# Altium project Sidekick Carrier - Rev. 1.PrjPcb (part 2 of 6)

## Sheet 5 Power Supplies.SchDoc
size C; DocumentNumber: 5; SheetNumber: 5; SheetTotal: 17
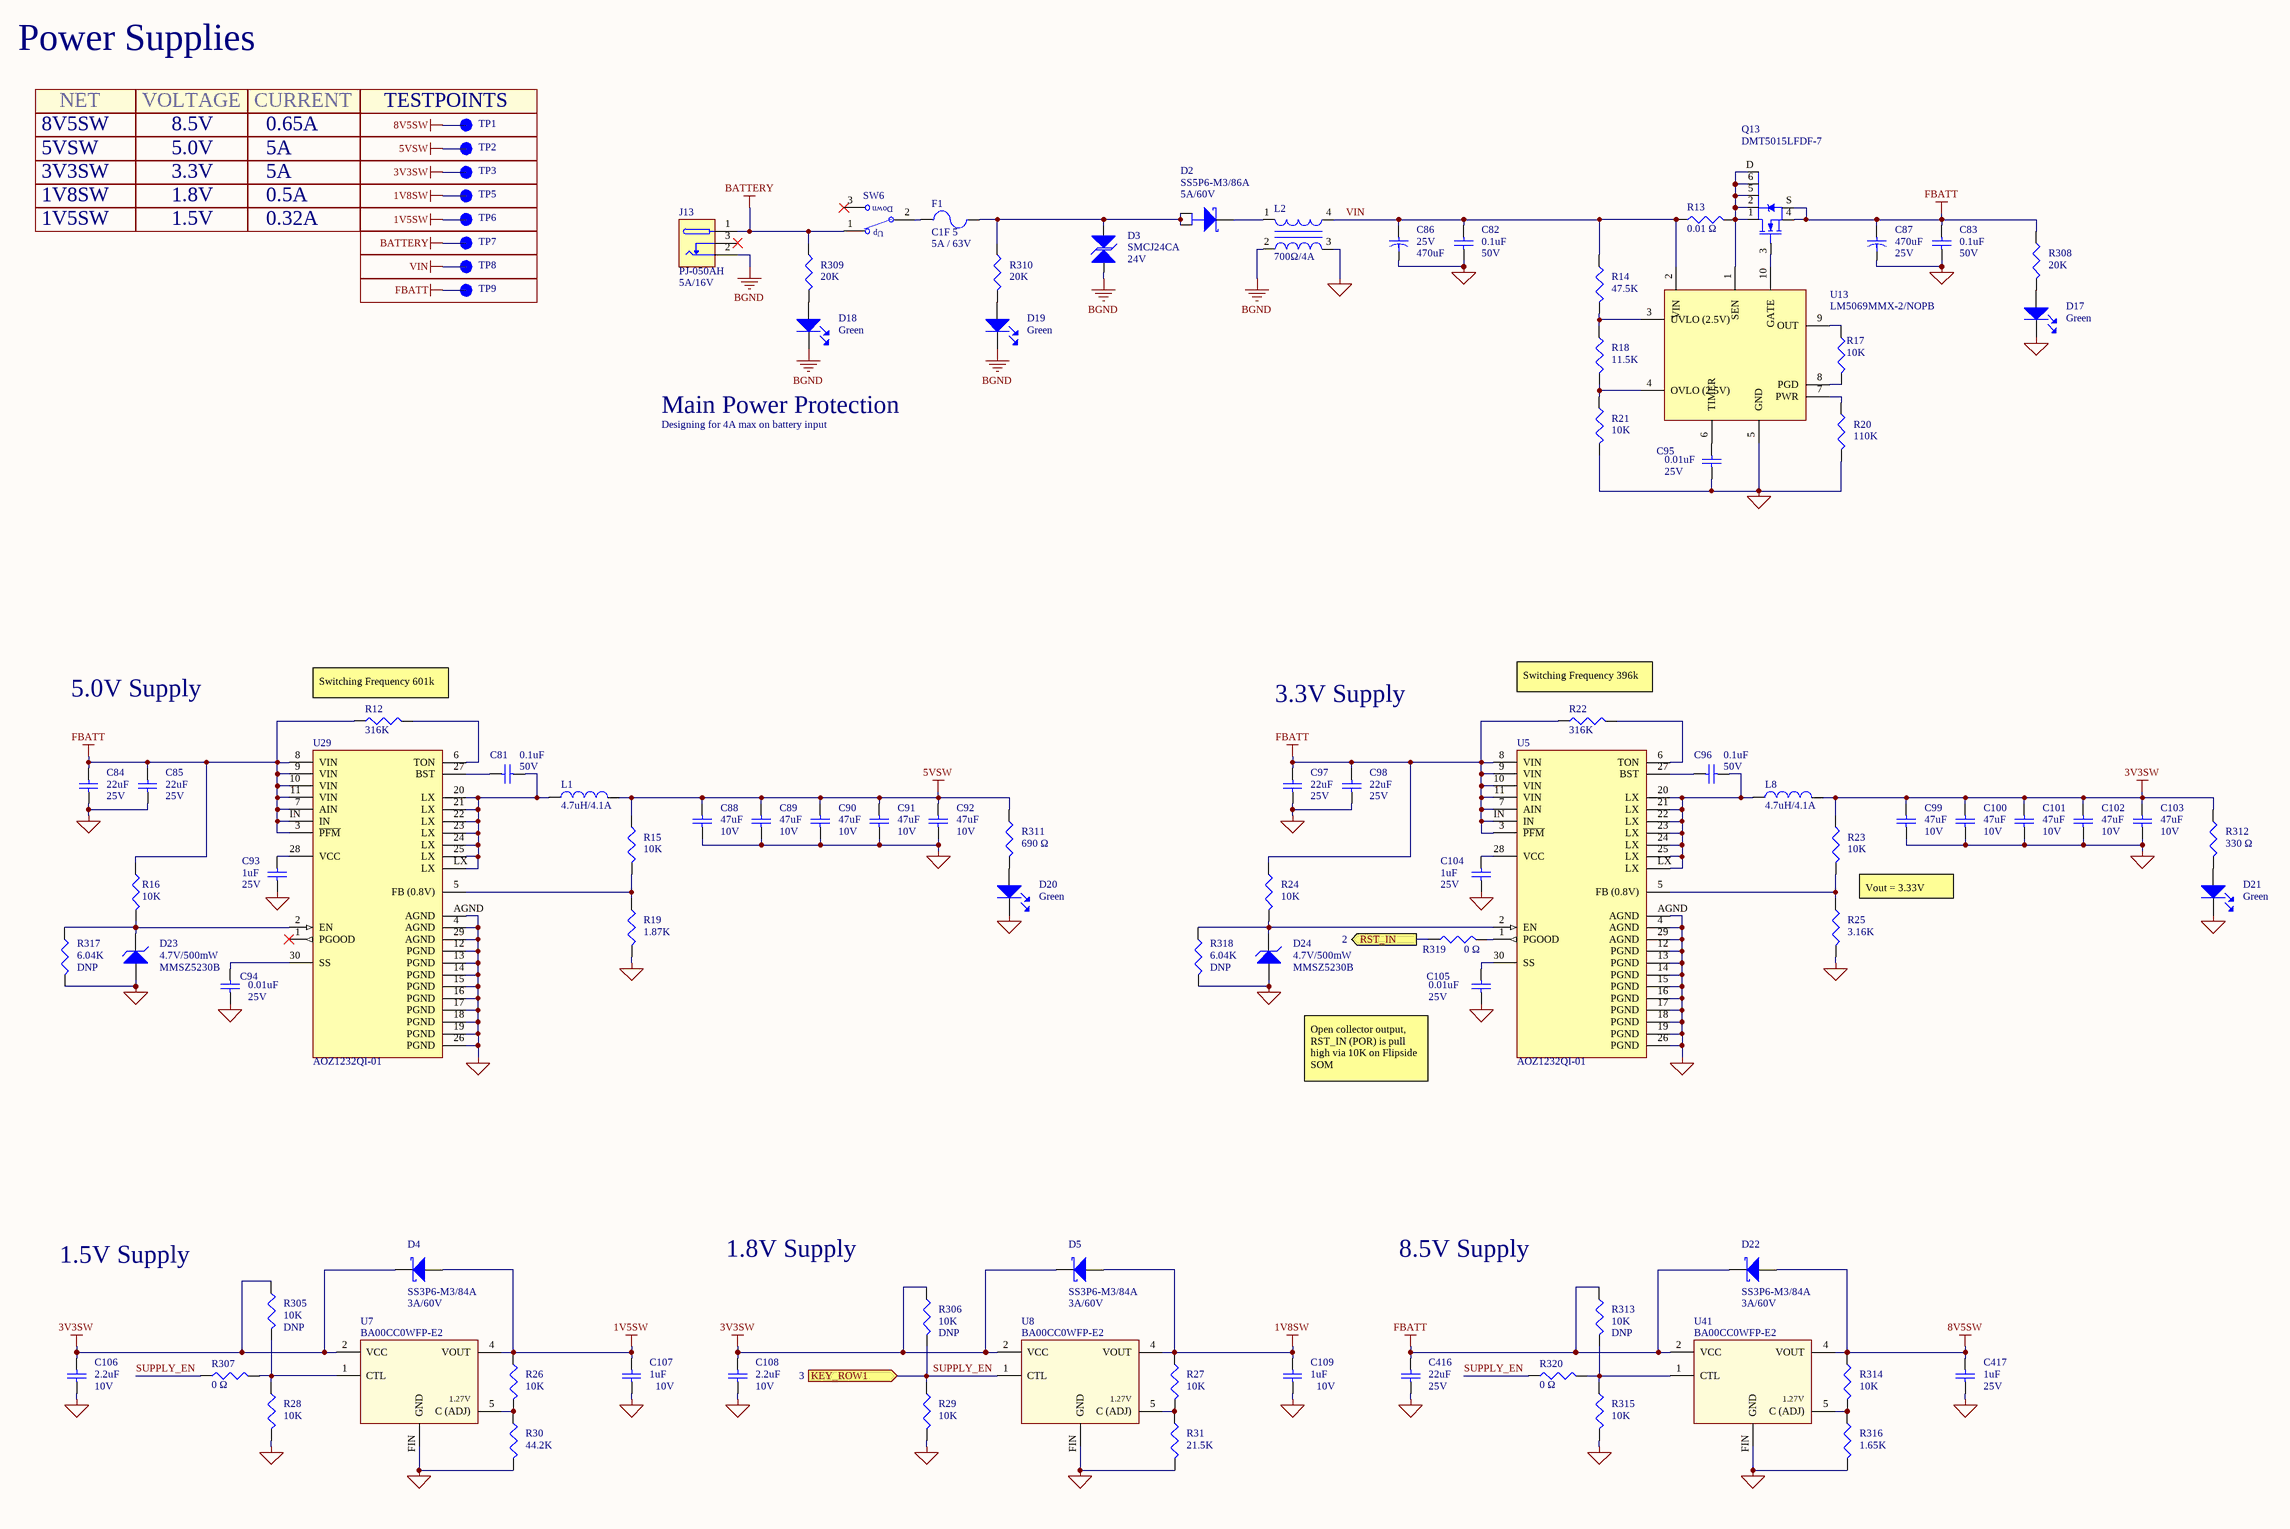
[diagram p4: 5 Power Supplies.SchDoc]

### Parts
C81  value 0.1uF  Voltage: 50V  [CAP_0402]  (hidden comment: Cap 0.1uF 50V 0402)
C82  value 0.1uF  Voltage: 50V  [CAP_0402]  (hidden comment: Cap 0.1uF 50V 0402)
C83  value 0.1uF  Voltage: 50V  [CAP_0402]  (hidden comment: Cap 0.1uF 50V 0402)
C84  value 22uF  Voltage: 25V  [CAP_0805]  (hidden comment: Cap 22uF 25V 0805)
C85  value 22uF  Voltage: 25V  [CAP_0805]  (hidden comment: Cap 22uF 25V 0805)
C86  value 470uF  Voltage: 25V  [SMD(8.3x8.3)_EEE-FT1E471AP]  (hidden comment: Cap 470uF 25V)
C87  value 470uF  Voltage: 25V  [SMD(8.3x8.3)_EEE-FT1E471AP]  (hidden comment: Cap 470uF 25V)
C88  value 47uF  Voltage: 10V  [CAP_1206]  (hidden comment: Cap 47uF 10V 1206)
C89  value 47uF  Voltage: 10V  [CAP_1206]  (hidden comment: Cap 47uF 10V 1206)
C90  value 47uF  Voltage: 10V  [CAP_1206]  (hidden comment: Cap 47uF 10V 1206)
C91  value 47uF  Voltage: 10V  [CAP_1206]  (hidden comment: Cap 47uF 10V 1206)
C92  value 47uF  Voltage: 10V  [CAP_1206]  (hidden comment: Cap 47uF 10V 1206)
C93  value 1uF  Voltage: 25V  [CAP_0402]  (hidden comment: Cap 1uF 25V 0402)
C94  value 0.01uF  Voltage: 25V  [CAP_0402]  (hidden comment: Cap 0.01uF 50V 0402)
C95  value 0.01uF  Voltage: 25V  [CAP_0402]  (hidden comment: Cap 0.01uF 50V 0402)
C96  value 0.1uF  Voltage: 50V  [CAP_0402]  (hidden comment: Cap 0.1uF 50V 0402)
C97  value 22uF  Voltage: 25V  [CAP_0805]  (hidden comment: Cap 22uF 25V 0805)
C98  value 22uF  Voltage: 25V  [CAP_0805]  (hidden comment: Cap 22uF 25V 0805)
C99  value 47uF  Voltage: 10V  [CAP_1206]  (hidden comment: Cap 47uF 10V 1206)
C100  value 47uF  Voltage: 10V  [CAP_1206]  (hidden comment: Cap 47uF 10V 1206)
C101  value 47uF  Voltage: 10V  [CAP_1206]  (hidden comment: Cap 47uF 10V 1206)
C102  value 47uF  Voltage: 10V  [CAP_1206]  (hidden comment: Cap 47uF 10V 1206)
C103  value 47uF  Voltage: 10V  [CAP_1206]  (hidden comment: Cap 47uF 10V 1206)
C104  value 1uF  Voltage: 25V  [CAP_0402]  (hidden comment: Cap 1uF 25V 0402)
C105  value 0.01uF  Voltage: 25V  [CAP_0402]  (hidden comment: Cap 0.01uF 50V 0402)
C106  value 2.2uF  Voltage: 10V  [CAP_0402]  (hidden comment: Cap 2.2uF 10V 0402)
C107  value 1uF  Voltage: 10V  [CAP_0402]  (hidden comment: Cap 1uF 10V 0402)
C108  value 2.2uF  Voltage: 10V  [CAP_0402]  (hidden comment: Cap 2.2uF 10V 0402)
C109  value 1uF  Voltage: 10V  [CAP_0402]  (hidden comment: Cap 1uF 10V 0402)
C416  value 22uF  Voltage: 25V  [CAP_0805]  (hidden comment: Cap 22uF 25V 0805)
C417  value 1uF  Voltage: 25V  [CAP_0402]  (hidden comment: Cap 1uF 25V 0402)
D2  SS5P6-M3/86A  value 5A/60V  [TO-277A_SS5P6]
D3  SMCJ24CA  value 24V  [SMC_SMCJ24CA]
D4  SS3P6-M3/84A  value 3A/60V  [DO-220AA_SS3P6-M3/84A]
D5  SS3P6-M3/84A  value 3A/60V  [DO-220AA_SS3P6-M3/84A]
D17  value Green  [LED_0603]  (hidden comment: LG L29K-G2J1-24-Z)
D18  value Green  [LED_0603]  (hidden comment: LG L29K-G2J1-24-Z)
D19  value Green  [LED_0603]  (hidden comment: LG L29K-G2J1-24-Z)
D20  value Green  [LED_0603]  (hidden comment: LG L29K-G2J1-24-Z)
D21  value Green  [LED_0603]  (hidden comment: LG L29K-G2J1-24-Z)
D22  SS3P6-M3/84A  value 3A/60V  [DO-220AA_SS3P6-M3/84A]
D23  MMSZ5230B  value 4.7V/500mW  [SOD-123_MMSZ5230B]
D24  MMSZ5230B  value 4.7V/500mW  [SOD-123_MMSZ5230B]
F1  C1F 5  value 5A / 63V  [FUSE_1206]
J13  PJ-050AH  value 5A/16V  [CONN_PJ-050AH]
L1  value 4.7uH/4.1A  [IND_NRS8040T4R7NJGJ]  (hidden comment: NRS8040T4R7NJGJ)
L2  value 700Ω/4A  [IND_ACM70V-701-2PL-TL00]  (hidden comment: ACM70V-701-2PL-TL00)
L8  value 4.7uH/4.1A  [IND_NRS8040T4R7NJGJ]  (hidden comment: NRS8040T4R7NJGJ)
Q13  DMT5015LFDF-7  [UDFN-6_DMT5015LFDF-7]
R12  value 316K  [RES_0402]  (hidden comment: Res 316K 0.063W)
R13  value 0.01 Ω  [RES_1210]  (hidden comment: Res 0.01 ohm 0.5W)
R14  value 47.5K  [RES_0402]  (hidden comment: Res 47.5K 0.063W)
R15  value 10K  [RES_0402]  (hidden comment: Res 10K 0.063W)
R16  value 10K  [RES_0402]  (hidden comment: Res 10K 0.063W)
R17  value 10K  [RES_0402]  (hidden comment: Res 10K 0.063W)
R18  value 11.5K  [RES_0402]  (hidden comment: Res 11.5K 0.063W)
R19  value 1.87K  [RES_0402]  (hidden comment: Res 1.87K 0.063W)
R20  value 110K  [RES_0402]  (hidden comment: Res 110K 0.063W)
R21  value 10K  [RES_0402]  (hidden comment: Res 10K 0.063W)
R22  value 316K  [RES_0402]  (hidden comment: Res 316K 0.063W)
R23  value 10K  [RES_0402]  (hidden comment: Res 10K 0.063W)
R24  value 10K  [RES_0402]  (hidden comment: Res 10K 0.063W)
R25  value 3.16K  [RES_0402]  (hidden comment: Res 3.16K 0.063W)
R26  value 10K  [RES_0402]  (hidden comment: Res 10K 0.063W)
R27  value 10K  [RES_0402]  (hidden comment: Res 10K 0.063W)
R28  value 10K  [RES_0402]  (hidden comment: Res 10K 0.063W)
R29  value 10K  [RES_0402]  (hidden comment: Res 10K 0.063W)
R30  value 44.2K  [RES_0402]  (hidden comment: Res 44.2K 0.063W)
R31  value 21.5K  [RES_0402]  (hidden comment: Res 21.5K 0.063W)
R305  value 10K  [RES_0402]  (hidden comment: Res 10K 0.063W)
R306  value 10K  [RES_0402]  (hidden comment: Res 10K 0.063W)
R307  value 0 Ω  [RES_0402]  (hidden comment: Res 0 ohm 0.1W)
R308  value 20K  [RES_0402]  (hidden comment: Res 20K 0.1W)
R309  value 20K  [RES_0402]  (hidden comment: Res 20K 0.1W)
R310  value 20K  [RES_0402]  (hidden comment: Res 20K 0.1W)
R311  value 690 Ω  [RES_0402]  (hidden comment: Res 680R 0.063W)
R312  value 330 Ω  [RES_0402]  (hidden comment: Res 330R 0.063W)
R313  value 10K  [RES_0402]  (hidden comment: Res 10K 0.063W)
R314  value 10K  [RES_0402]  (hidden comment: Res 10K 0.063W)
R315  value 10K  [RES_0402]  (hidden comment: Res 10K 0.063W)
R316  value 1.65K  [RES_0402]  (hidden comment: Res 1.65K 0.1W)
R317  value 6.04K  [RES_0402]  (hidden comment: Res 6.04K 0.063W)
R318  value 6.04K  [RES_0402]  (hidden comment: Res 6.04K 0.063W)
R319  value 0 Ω  [RES_0402]  (hidden comment: Res 0 ohm 0.1W)
R320  value 0 Ω  [RES_0402]  (hidden comment: Res 0 ohm 0.1W)
SW6  M2012S3S2W40  [SW_M2012S3S2W40]  (value not drawn)
TP1  TP  [TP_TH_12_20]  (value not drawn)  (no BOM)
TP2  TP  [TP_TH_12_20]  (value not drawn)  (no BOM)
TP3  TP  [TP_TH_12_20]  (value not drawn)  (no BOM)
TP5  TP  [TP_TH_12_20]  (value not drawn)  (no BOM)
TP6  TP  [TP_TH_12_20]  (value not drawn)  (no BOM)
TP7  TP  [TP_TH_12_20]  (value not drawn)  (no BOM)
TP8  TP  [TP_TH_12_20]  (value not drawn)  (no BOM)
TP9  TP  [TP_TH_12_20]  (value not drawn)  (no BOM)
U5  AOZ1232QI-01  [QFN(5x5)_AOZ1232QI-01]
U7  BA00CC0WFP-E2  [TO-252-5_BA00CC0WFP-E2]
U8  BA00CC0WFP-E2  [TO-252-5_BA00CC0WFP-E2]
U13  LM5069MMX-2/NOPB  [VSSOP-10_LM5069]
U29  AOZ1232QI-01  [QFN(5x5)_AOZ1232QI-01]
U41  BA00CC0WFP-E2  [TO-252-5_BA00CC0WFP-E2]

### Blocks framed on the sheet
TESTPOINTS: TP1

### Ports
KEY_ROW1 (in, see 3), RST_IN (out, see 2)

### Nets
1V5SW: C107.1 D4.A R26.1 TP6.1 U7.4(VOUT)
1V8SW: C109.1 D5.A R27.1 TP5.1 U8.4(VOUT)
3V3SW: C99.1 C100.1 C101.1 C102.1 C103.1 C106.1 C108.1 D4.K D5.K L8.2 R23.1 R305.1 R306.1 R312.1 TP3.1 U7.2(VCC) U8.2(VCC)
5VSW: C88.1 C89.1 C90.1 C91.1 C92.1 L1.2 R15.1 R311.1 TP2.1
8V5SW: C417.1 D22.A R314.1 TP1.1 U41.4(VOUT)
BATTERY: J13.1 R309.1 SW6.1 TP7.1
BGND: D3.2 D18.K D19.K J13.2 L2.2
FBATT: C83.1 C84.1 C85.1 C87.1 C97.1 C98.1 C416.1 D22.K Q13.4(S) Q13.S R12.1 R16.1 R22.1 R24.1 R308.1 R313.1 TP9.1 U5.3(~{PFM}) U5.7(AIN) U5.8(VIN) U5.9(VIN) U5.10(VIN) U5.11(VIN) U5.IN U29.3(~{PFM}) U29.7(AIN) U29.8(VIN) U29.9(VIN) U29.10(VIN) U29.11(VIN) U29.IN U41.2(VCC)
GND: C82.2 C83.2 C84.2 C85.2 C86.2 C87.2 C88.2 C89.2 C90.2 C91.2 C92.2 C93.2 C94.2 C95.2 C97.2 C98.2 C99.2 C100.2 C101.2 C102.2 C103.2 C104.2 C105.2 C106.2 C107.2 C108.2 C109.2 C416.2 C417.2 D17.K D20.K D21.K D23.A D24.A L2.3 R19.2 R20.2 R21.2 R25.2 R28.2 R29.2 R30.2 R31.2 R315.2 R316.2 R317.2 R318.2 U5.4(AGND) U5.12(PGND) U5.13(PGND) U5.14(PGND) U5.15(PGND) U5.16(PGND) U5.17(PGND) U5.18(PGND) U5.19(PGND) U5.26(PGND) U5.29(AGND) U5.AGND U7.FIN(GND) U8.FIN(GND) U13.5(GND) U29.4(AGND) U29.12(PGND) U29.13(PGND) U29.14(PGND) U29.15(PGND) U29.16(PGND) U29.17(PGND) U29.18(PGND) U29.19(PGND) U29.26(PGND) U29.29(AGND) U29.AGND U41.FIN(GND)
VIN: C82.1 C86.1 L2.4 R13.1 R14.1 TP8.1 U13.2(VIN)
POR: R319.1 ; port RST_IN
SUPPLY_EN: R29.1 R306.2 R307.1 R320.1 U8.1(CTL) ; port KEY_ROW1
NetC81_1: C81.1 L1.1 U29.20(LX) U29.21(LX) U29.22(LX) U29.23(LX) U29.24(LX) U29.25(LX) U29.LX
NetC81_2: C81.2 U29.27(BST)
NetC93_1: C93.1 U29.28(VCC)
NetC94_1: C94.1 U29.30(SS)
NetC95_1: C95.1 U13.6(TIMER)
NetC96_1: C96.1 L8.1 U5.20(LX) U5.21(LX) U5.22(LX) U5.23(LX) U5.24(LX) U5.25(LX) U5.LX
NetC96_2: C96.2 U5.27(BST)
NetC104_1: C104.1 U5.28(VCC)
NetC105_1: C105.1 U5.30(SS)
NetD2_1: D2.1 D2.2 D3.1 F1.2 R310.1
NetD2_K: D2.K L2.1
NetD17_A: D17.A R308.2
NetD18_A: D18.A R309.2
NetD19_A: D19.A R310.2
NetD20_A: D20.A R311.2
NetD21_A: D21.A R312.2
NetD23_K: D23.K R16.2 R317.1 U29.2(EN)
NetD24_K: D24.K R24.2 R318.1 U5.2(EN)
NetF1_1: F1.1 SW6.2
NetQ13_1: Q13.1(D) Q13.2(D) Q13.5(D) Q13.6(D) Q13.D R13.2 U13.1(SEN)
NetQ13_3: Q13.3(G) U13.10(GATE)
NetR12_2: R12.2 U29.6(TON)
NetR14_2: R14.2 R18.1 U13.3(UVLO_(2.5V))
NetR15_2: R15.2 R19.1 U29.5(FB_(0.8V))
NetR17_1: R17.1 U13.9(OUT)
NetR17_2: R17.2 U13.8(PGD)
NetR18_2: R18.2 R21.1 U13.4(OVLO_(2.5V))
NetR20_1: R20.1 U13.7(PWR)
NetR22_2: R22.2 U5.6(TON)
NetR23_2: R23.2 R25.1 U5.5(FB_(0.8V))
NetR26_2: R26.2 R30.1 U7.5(C_(ADJ))
NetR27_2: R27.2 R31.1 U8.5(C_(ADJ))
NetR28_1: R28.1 R305.2 R307.2 U7.1(CTL)
NetR313_2: R313.2 R315.1 R320.2 U41.1(CTL)
NetR314_2: R314.2 R316.1 U41.5(C_(ADJ))
NetR319_2: R319.2 U5.1(PGOOD)

Not connected (* = marked no-connect by the designer): J13 3(2)*; SW6 3*; U29 1(PGOOD)*

### Notes on the sheet
- Power Supplies
- NET
- VOLTAGE
- CURRENT
- 8V5SW
- 5VSW
- 8.5V
- 5.0V
- 0.65A
- 5A
- 3V3SW
- 1V8SW
- 1V5SW
- 3.3V
- 1.8V
- 1.5V
- 0.5A
- 0.32A
- Designing for 4A max on battery input
- Main Power Protection
- 5.0V Supply
- (near R12) Switching Frequency 601k
- 3.3V Supply
- (near R22) Switching Frequency 396k
- Vout = 3.33V
- Open collector output, RST_IN (POR) is pull high via 10K on Flipside SOM
- 1.5V Supply
- 1.8V Supply
- 8.5V Supply
- First View Consultants
- Austin, Tx
- 512.582.9102
- firstviewconsultants.com
- Title:
- File:
- Drawn:
- Sheet
- of
- FVC #:
- Checked:
- Approved:
- Date:
- Page Size:
- C
- Rev.
- Time:
- (in symbol BA00CC0WFP-E2) 1.27V
- (in symbol M2012S3S2W40) Down; Up

### Library data of the parts
C81-C83 C96 = Cap 0.1uF 50V 0402: Cap, Cer, 0.1uF, 50V, 10%, X5R, 0402; Manufacturer #: C1005X5R1H104K; Manufacturer: TDK Corporation; Have Footprint: yes; Tolerance: ±10%; Package: 0402
C84 C85 C97 C98 C416 = Cap 22uF 25V 0805: Cap, Cer, 22uF, 25V, 20%, X5R, 0805; Manufacturer #: CL21A226MAQNNNE; Manufacturer: Samsung Electro-Mechanics America, Inc; Have Footprint: yes; Tolerance: ±20%; Package: 0805
C86 C87 = Cap 470uF 25V: Cap, Alum, 470uF, 25V, 20%, 80 mOhm, SMD; Manufacturer #: EEE-FT1E471AP; Manufacturer: Panasonic Electronic Components; Tolerance: 20%; Package: SMD  (8.3x8.3); Operating Temperature: -55°C ~ 105°C
C88-C92 C99-C103 = Cap 47uF 10V 1206: as C337 on sheet 3 MXM Connector 2; Package: 1206
C93 C104 C417 = Cap 1uF 25V 0402: Cap, Cer, 1uF, 25V, 10%, X5R, 0402; Manufacturer #: TMK105BJ105MV-F; Manufacturer: Taiyo Yuden; Have Footprint: yes; Package: 0402
C94 C95 C105 = Cap 0.01uF 50V 0402: Cap, Cer, 0.01uF, 25V, ±10%, X7R, 0402; Manufacturer #: GRM155R71E103KA01J; Manufacturer: Murata; Have Footprint: yes; Tolerance: ±10%; Package: 0402
C106 C108 = Cap 2.2uF 10V 0402: Cap, Cer, 2.2uF, 10V, 10%, X5R, 0402; Manufacturer #: C0402C225M8PACTU; Manufacturer: Kemet; Have Footprint: yes; Package: 0402
C107 C109 = Cap 1uF 10V 0402: Cap, Cer, 1uF, 10V, ±10%, X5R, 0402; Manufacturer #: CC0402KRX5R6BB105; Manufacturer: Yageo; Have Footprint: yes; Package: 0402
D2 = SS5P6-M3/86A: Diode, Schottky, 5A, 60V, TO-277A; Manufacturer: Vishay Semiconductor Diodes Division; RΘJA: 65; RΘJL: 3; Package: TO-277A; Manufacturer #: SS5P6-M3/86A
D3 = SMCJ24CA: Diode, TVS, 24V, 1500W, SMC; Manufacturer: Littelfuse Inc; Operating Temperature: -55°C ~ 150°C; Package: SMC; RoHS: yes; Manufacturer #: SMCJ24CA
D4 D5 D22 = SS3P6-M3/84A: Diode, Schottky, 3A, 60V, DO-220AA; Manufacturer: Vishay; Package: DO-220AA; Manufacturer #: SS3P6-M3/84A
D17-D21 = LG L29K-G2J1-24-Z: Led, Green, 2mA, 1.7V, 0603; Manufacturer: OSRAM Opto Semiconductors Inc; Have Footprint: yes; RoHS: yes; Operating Temperature: -40°C ~ 125°C; Package: 0603; Manufacturer #: LG L29K-G2J1-24-Z
D23 D24 = MMSZ5230B: as D1 on sheet 4 Connectors; Package: SOD-123; Manufacturer #: MMSZ5230B
F1 = C1F 5: Fuse, 5A, 63V, 1206; Manufacturer: Bel Fuse Inc; Operating Temperature: -55°C ~ 125°C; RoHS: yes; Manufacturer #: C1F 5
J13 = PJ-050AH: Conn, Power Jack, 2.1x5mm, R/A, TH; Manufacturer: CUI Inc; Voltage: 16V; Manufacturer #: PJ-050AH
L1 L8 = NRS8040T4R7NJGJ: Ind, Power, 4.7uH, 4.1A, 23.4mOhm, Shielded, SMD; Manufacturer: Taiyo Yuden; Manufacturer #: NRS8040T4R7NJGJ; Package: SMD (8x8)
L2 = ACM70V-701-2PL-TL00: Ind, Choke, Common Mode, 700R, 4A, SMD; Manufacturer: TDK Corporation; Have Footprint: yes; Package: SMD (7x6); Operating Temperature: -40°C ~ 125°C; Manufacturer #: ACM70V-701-2PL-TL00
Q13 = DMT5015LFDF-7: Transistor, N-MOS, 9.1A, 50V, 15 mOhm, UDFN-6; Manufacturer: Diodes Incorporated; Value: 9.1A/50V; RθJA: 67; Manufacturer #: DMT5015LFDF-7; Package: 6-UDFN2020 (2x2); Voltage: 50V
R12 R22 = Res 316K 0.063W: Res, 316K, 0.063W, 1%, 0402; Manufacturer #: RMCF0402FT316K; Manufacturer: Stackpole Electronics Inc; Have Footprint: yes; Package: 0402
R13 = Res 0.01 ohm 0.5W: Res, 0.01 ohm, 0.5W, 1%, 1210; Manufacturer #: RL1210FR-070R01L; Manufacturer: Yageo; Have Footprint: yes; Package: 1210
R14 = Res 47.5K 0.063W: Res, 47.5K, 0.063W, 1%, 0402; Manufacturer #: RMCF0402FT47K5; Manufacturer: Stackpole Electronics Inc; Have Footprint: yes; Package: 0402
R15-R17 R21 R23 R24 R26-R29 R305 R306 R313-R315 = Res 10K 0.063W: as R327 on sheet 2 MXM Connector 1; Package: 0402
  R305 R306 R315: DNP: DNP
R18 = Res 11.5K 0.063W: Res, 11.5K, 0.063W, 1%, 0402; Manufacturer #: RMCF0402FT11K5; Manufacturer: Stackpole Electronics Inc; Have Footprint: yes; Package: 0402
R19 = Res 1.87K 0.063W: Res, 1.87K, 0.063W, 1%, 0402; Manufacturer #: RMCF0402FT1K87; Manufacturer: Stackpole Electronics Inc; Have Footprint: yes; Package: 0402; Tolerance: 1%
R20 = Res 110K 0.063W: Res, 110K, 0.063W, 5%, 0402; Manufacturer #: MCR01MRTJ114; Manufacturer: Rohm Semiconductor; Have Footprint: yes; Package: 0402; Tolerance: 5%
R25 = Res 3.16K 0.063W: Res, 3.16K, 0.063W, 1%, 0402; Manufacturer #: RMCF0402FT3K16; Manufacturer: Stackpole Electronics Inc; Have Footprint: yes; Package: 0402
R30 = Res 44.2K 0.063W: Res, 44.2K, 0.063W, 1%, 0402; Manufacturer #: RMCF0402FT44K2; Manufacturer: Stackpole Electronics Inc; Have Footprint: yes; Package: 0402
R31 = Res 21.5K 0.063W: Res, 21.5K, 0.063W, 1%, 0402; Manufacturer #: ERJ-2RKF2152X; Manufacturer: Panasonic Electronic Components; Have Footprint: yes; Package: 0402
R307 R319 R320 = Res 0 ohm 0.1W: as R328 on sheet 2 MXM Connector 1; Package: 0402
R308-R310 = Res 20K 0.1W: Res, 20K, 0.1W, 1%, 0402; Manufacturer #: ERJ-2RKF2002X; Manufacturer: Panasonic Electronic Components; Have Footprint: yes; Package: 0402
R311 = Res 680R 0.063W: Res, 680R, 0.063W, 1%, 0402; Manufacturer #: RMCF0402JT680R; Manufacturer: Stackpole Electronics Inc; Have Footprint: yes; Package: 0402; Tolerance: ±1%
R312 = Res 330R 0.063W: Res, 330R, 0.063W, 1%, 0402; Manufacturer #: RC0402FR-07330RL; Manufacturer: Yageo; Have Footprint: yes; Package: 0402; Cost: *
R316 = Res 1.65K 0.1W: Res, 1.65K, 0.1W, 1%, 0402; Manufacturer #: ERJ-2RKF1651X; Manufacturer: Panasonic Electronic Components; Have Footprint: yes; Package: 0402; Tolerance: 1%
R317 R318 = Res 6.04K 0.063W: Res, 6.04K, 0.063W, 1%, 0402; Manufacturer #: RT0402FRE076K04L; Manufacturer: Yageo; Have Footprint: yes; Tolerance: ±1%; RoHS: yes; Cost: *; Package: 0402; DNP: DNP
SW6 = M2012S3S2W40: Switch, Toggle, SPDT, 30V, 4A, RT, TH; Manufacturer: NKK Switches; Have Footprint: yes; Manufacturer #: M2012S3S2W40
TP1-TP3 TP5-TP9 = TestPoint: Testpad; DNP: DNP
U5 U29 = AOZ1232QI-01: IC, Power, Buck, 6A, AOZ1232QI-01, 30-QFN (5x5); Manufacturer: Alpha & Omega; Have Footprint: yes; Manufacturer #: AOZ1232QI-01
U7 U8 U41 = BA00CC0WFP-E2: LDO, Adj., 1A, 4-25V, TO-252-2; Manufacturer: Rohm Semiconductor; θJA: 62.5; Value: Adj./1A; Package: TO-252-5; Operating Temperature: -40°C ~ 125°C; RoHS: yes; Manufacturer #: BA00CC0WFP-E2
U13 = LM5069MMX-2/NOPB: IC, Power, Hot Swap Controller, VSSOP-10; Manufacturer: Texas Instruments; Have Footprint: yes; Manufacturer #: LM5069MMX-2/NOPB; Package: VSSOP-10